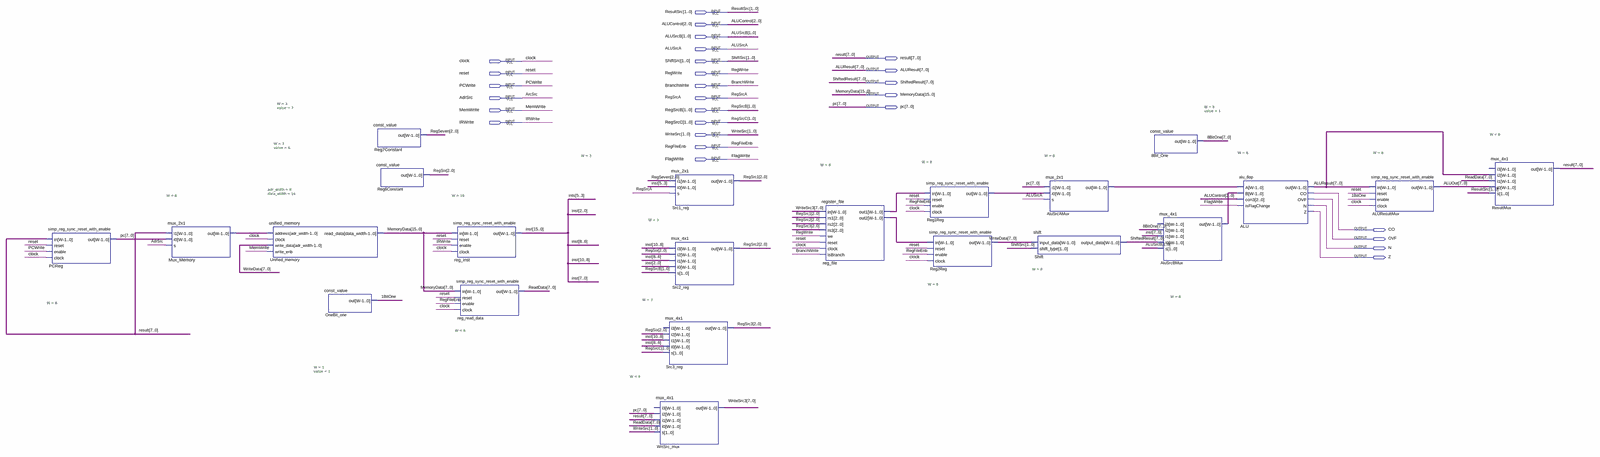
[diagram p0: schematic sheet, whole]
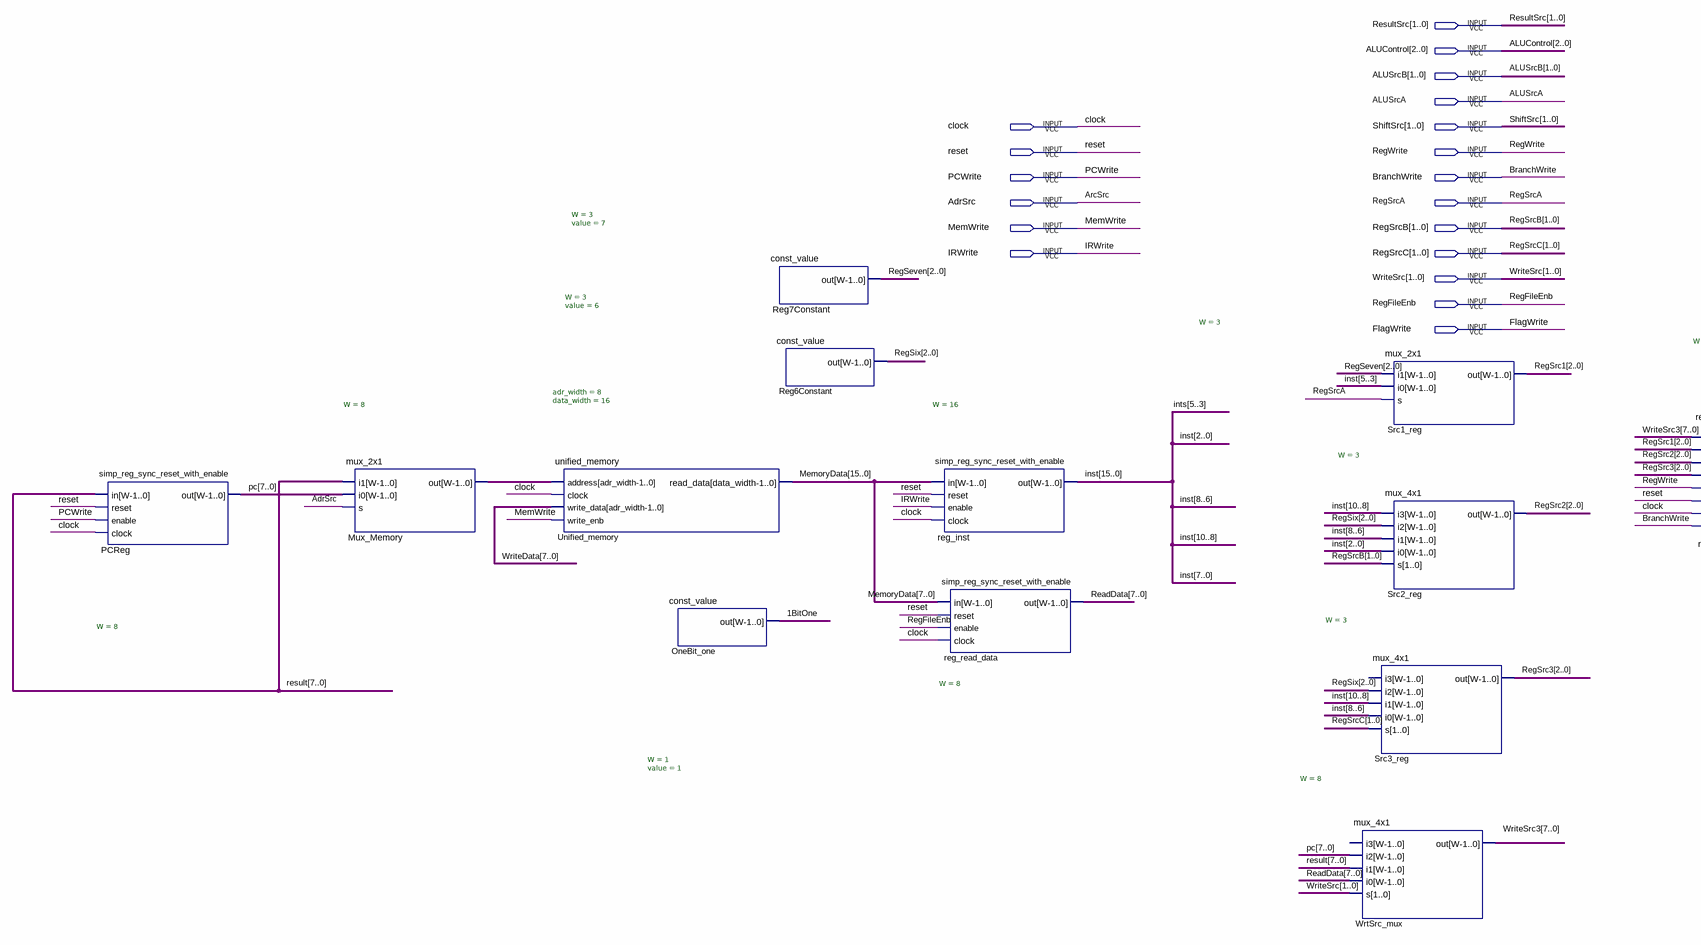
[diagram p1: schematic sheet, left part]
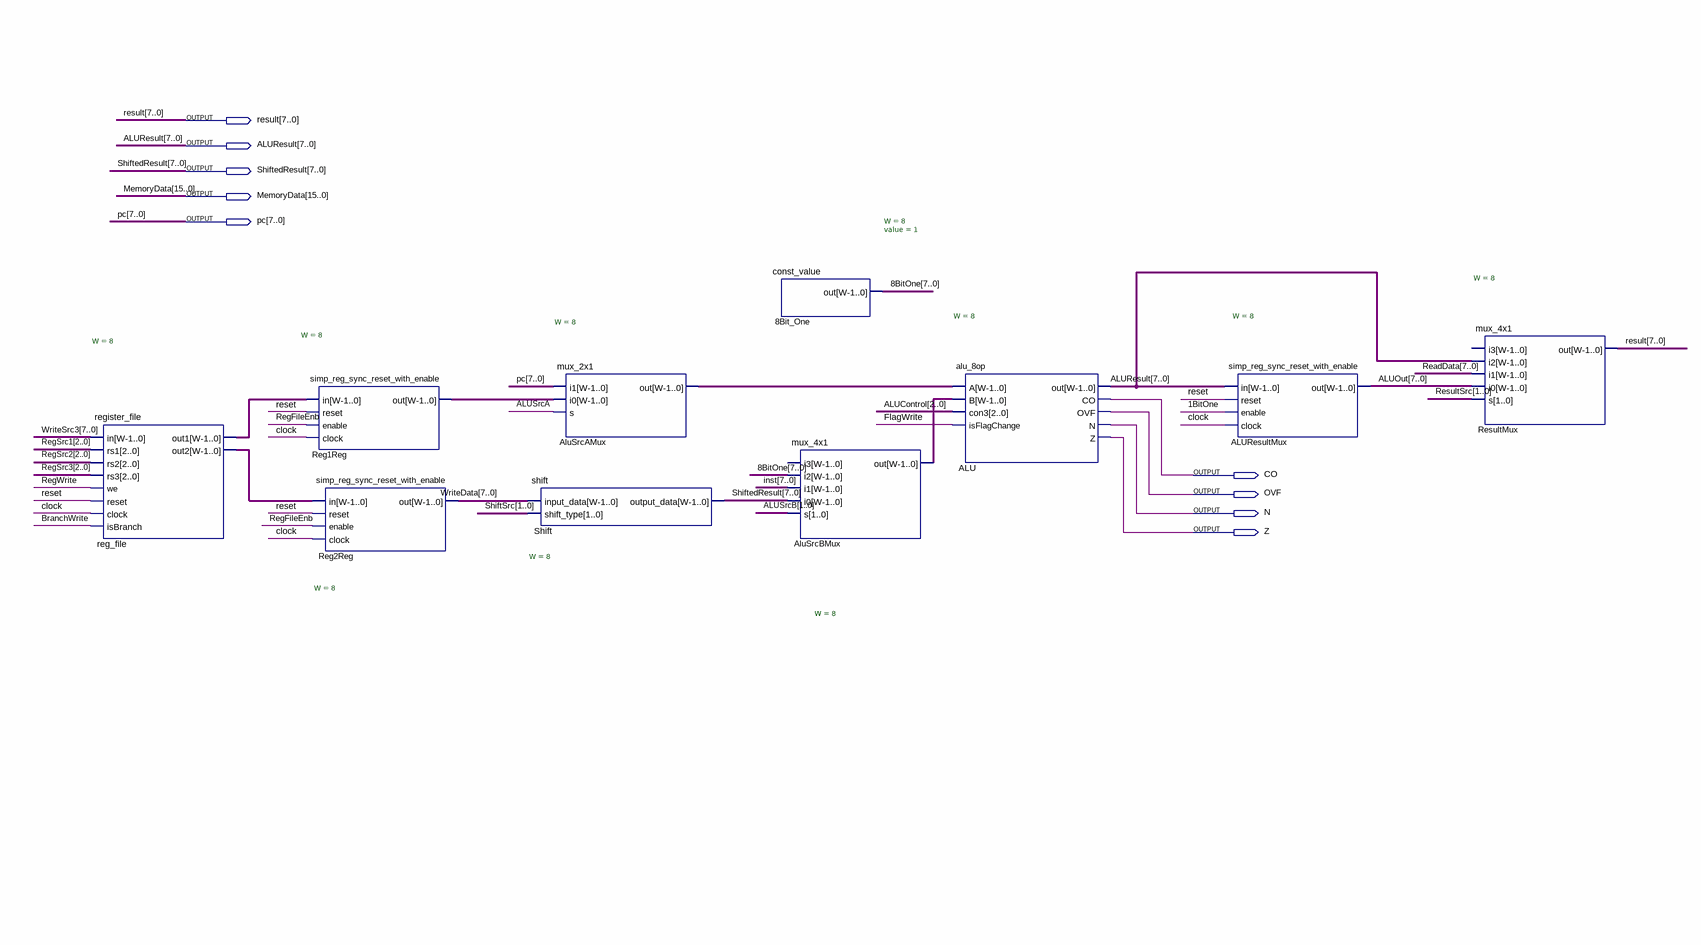
[diagram p2: schematic sheet, right part]
// Quartus schematic datapath.bdf as structural Verilog: 22 symbols, 28 pins
module datapath (
  input  [1:0] ResultSrc,
  input  [2:0] ALUControl,
  input  [1:0] ALUSrcB,
  input  ALUSrcA,
  input  clock,
  input  [1:0] ShiftSrc,
  input  reset,
  input  RegWrite,
  input  PCWrite,
  input  BranchWrite,
  input  AdrSrc,
  input  RegSrcA,
  input  MemWrite,
  input  [1:0] RegSrcB,
  input  IRWrite,
  input  [1:0] RegSrcC,
  input  [1:0] WriteSrc,
  input  RegFileEnb,
  input  FlagWrite,
  output [7:0] result,
  output [7:0] ALUResult,
  output [7:0] ShiftedResult,
  output [15:0] MemoryData,
  output [7:0] pc,
  output CO,
  output OVF,
  output N,
  output Z
);

  wire \1BitOne ;
  wire [2:0] RegSeven, RegSix, RegSrc1, RegSrc2, RegSrc3;
  wire [7:0] \8BitOne , ALUOut, AluSrcAMux_out, AluSrcBMux_out, Mux_Memory_out, ReadData, Reg1Reg_out,
       reg_file_out1, reg_file_out2, WriteData, WriteSrc3;
  wire [15:0] inst;

  simp_reg_sync_reset_with_enable #(.W(8)) PCReg (
    .in(result), .reset(reset), .enable(PCWrite), .clock(clock), .out(pc));
  mux_2x1 #(.W(8)) Mux_Memory (.i1(result), .i0(pc), .s(AdrSrc), .out(Mux_Memory_out));
  unified_memory #(.adr_width(8), .data_width(16)) Unified_memory (
    .address(Mux_Memory_out), .clock(clock), .write_data(WriteData), .write_enb(MemWrite),
    .read_data(MemoryData));
  const_value #(.W(1), .value(1)) OneBit_one (.out(\1BitOne ));
  const_value #(.W(3), .value(7)) Reg7Constant (.out(RegSeven));
  const_value #(.W(3), .value(6)) Reg6Constant (.out(RegSix));
  simp_reg_sync_reset_with_enable #(.W(16)) reg_inst (
    .in(MemoryData), .reset(reset), .enable(IRWrite), .clock(clock), .out(inst));
  simp_reg_sync_reset_with_enable #(.W(8)) reg_read_data (
    .in(MemoryData[7:0]), .reset(reset), .enable(RegFileEnb), .clock(clock), .out(ReadData));
  mux_4x1 #(.W(8)) WrtSrc_mux (.i2(pc), .i1(result), .i0(ReadData), .s(WriteSrc), .out(WriteSrc3));  // open: i3
  mux_2x1 #(.W(3)) Src1_reg (.i1(RegSeven), .i0(inst[5:3]), .s(RegSrcA), .out(RegSrc1));
  mux_4x1 #(.W(3)) Src2_reg (.i3(inst[10:8]), .i2(RegSix), .i1(inst[8:6]), .i0(inst[2:0]), .s(RegSrcB), .out(RegSrc2));
  mux_4x1 #(.W(3)) Src3_reg (.i2(RegSix), .i1(inst[10:8]), .i0(inst[8:6]), .s(RegSrcC), .out(RegSrc3));  // open: i3
  register_file #(.W(8)) reg_file (
    .in(WriteSrc3), .rs1(RegSrc1), .rs2(RegSrc2), .rs3(RegSrc3), .we(RegWrite), .reset(reset), .clock(clock),
    .isBranch(BranchWrite), .out1(reg_file_out1), .out2(reg_file_out2));
  simp_reg_sync_reset_with_enable #(.W(8)) Reg1Reg (
    .in(reg_file_out1), .reset(reset), .enable(RegFileEnb), .clock(clock), .out(Reg1Reg_out));
  simp_reg_sync_reset_with_enable #(.W(8)) Reg2Reg (
    .in(reg_file_out2), .reset(reset), .enable(RegFileEnb), .clock(clock), .out(WriteData));
  mux_2x1 #(.W(8)) AluSrcAMux (.i1(pc), .i0(Reg1Reg_out), .s(ALUSrcA), .out(AluSrcAMux_out));
  shift #(.W(8)) Shift (.input_data(WriteData), .shift_type(ShiftSrc), .output_data(ShiftedResult));
  const_value #(.W(8), .value(1)) u_8Bit_One (.out(\8BitOne ));
  mux_4x1 #(.W(8)) AluSrcBMux (
    .i2(\8BitOne ), .i1(inst[7:0]), .i0(ShiftedResult), .s(ALUSrcB), .out(AluSrcBMux_out));  // open: i3
  alu_8op #(.W(8)) ALU (
    .A(AluSrcAMux_out), .B(AluSrcBMux_out), .con3(ALUControl), .isFlagChange(FlagWrite), .out(ALUResult),
    .CO(CO), .OVF(OVF), .N(N), .Z(Z));
  simp_reg_sync_reset_with_enable #(.W(8)) ALUResultMux (
    .in(ALUResult), .reset(reset), .enable(\1BitOne ), .clock(clock), .out(ALUOut));
  mux_4x1 #(.W(8)) ResultMux (.i2(ALUResult), .i1(ReadData), .i0(ALUOut), .s(ResultSrc), .out(result));  // open: i3

  // Other names for the same wires on the sheet: ArcSrc = AdrSrc
endmodule
